# Altium schematic sheet pa.SchDoc: Class D DC/DC
size A4; Address4: Niklas Fauth; Revision: V1.0; SheetNumber: 3; SheetTotal: 5
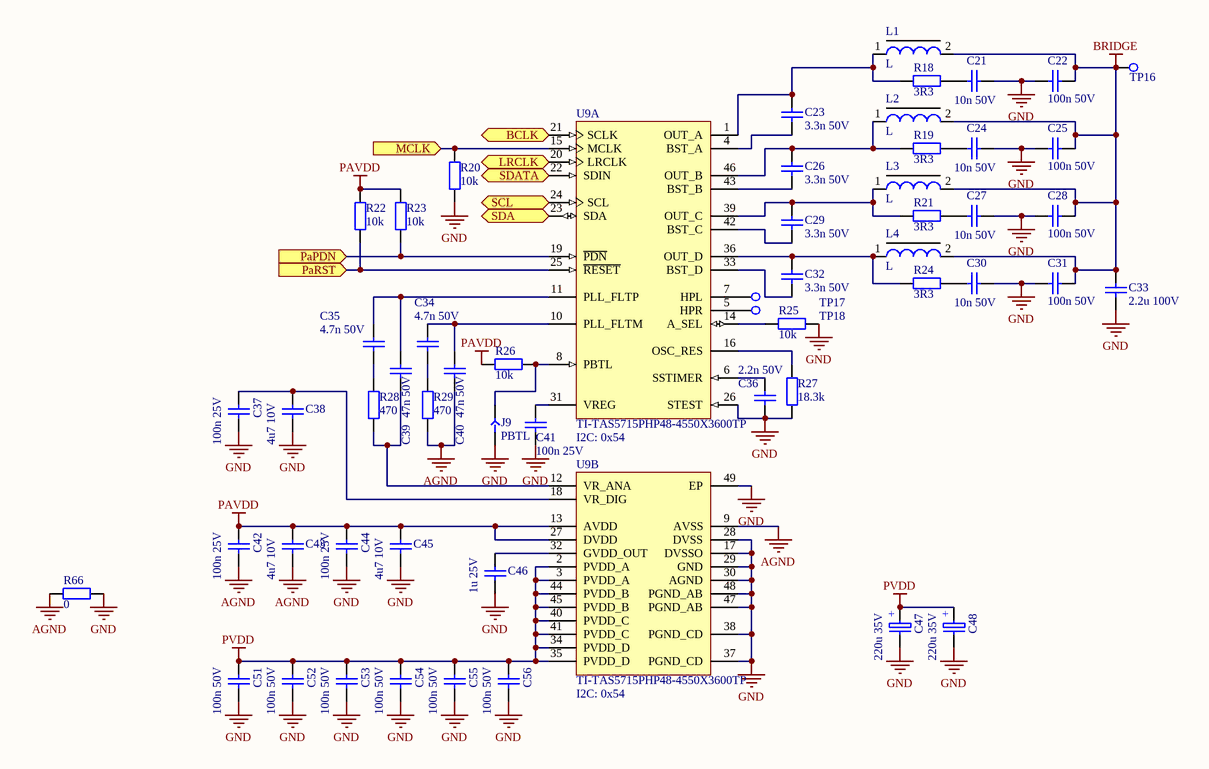
[diagram p0: pa.SchDoc]

## Parts
C21  10n 50V  [C-0603-H]
C22  100n 50V  [C-0805-H]
C23  3.3n 50V  [C-0603-H]
C24  10n 50V  [C-0603-H]
C25  100n 50V  [C-0805-H]
C26  3.3n 50V  [C-0603-H]
C27  10n 50V  [C-0603-H]
C28  100n 50V  [C-0805-H]
C29  3.3n 50V  [C-0603-H]
C30  10n 50V  [C-0603-H]
C31  100n 50V  [C-0805-H]
C32  3.3n 50V  [C-0603-H]
C33  2.2u 100V  [C-1210-M]
C34  4.7n 50V  [C-0603-H]
C35  4.7n 50V  [C-0603-H]
C36  2.2n 50V  [C-0603-H]
C37  100n 25V  [C-0603-H]
C38  4u7 10V  [C-0603-H]
C39  47n 50V  [C-0603-M]
C40  47n 50V  [C-0603-M]
C41  100n 25V  [C-0603-H]
C42  100n 25V  [C-0603-H]
C43  4u7 10V  [C-0603-H]
C44  100n 25V  [C-0603-H]
C45  4u7 10V  [C-0603-H]
C46  1u 25V  [C-0603-H]
C47  220u 35V  [SMD-10x10]
C48  220u 35V  [SMD-10x10]
C51  100n 50V  [C-0603-H]
C52  100n 50V  [C-0603-H]
C53  100n 50V  [C-0603-H]
C54  100n 50V  [C-0603-H]
C55  100n 50V  [C-0603-H]
C56  100n 50V  [C-0603-H]
J9  PBTL  [jmpr]
L1  L  [L-SDR1105]
L2  L  [L-SDR1105]
L3  L  [L-SDR1105]
L4  L  [L-SDR1105]
R18  3R3  [R-0603-H]
R19  3R3  [R-0603-H]
R20  10k  [R-0603-H]
R21  3R3  [R-0603-H]
R22  10k  [R-0603-H]
R23  10k  [R-0603-H]
R24  3R3  [R-0603-H]
R25  10k  [R-0603-H]
R26  10k  [R-0603-H]
R27  18.3k  [R-0603-M]
R28  470  [R-0603-H]
R29  470  [R-0603-H]
R66  0  [R-0603-M]
TP16  TP-SMD  [TP]  (value not drawn)
TP17  TP-SMD  [TP]  (value not drawn)
TP18  TP-SMD  [TP]  (value not drawn)
U9  TI-TAS5715PHP48-4550X3600TP  [TI-PHP48-4550X3600TP_N]  (parts A,B of 2)

## Ports
BCLK (in), LRCLK (in), MCLK (in), PaPDN (in), PaRST (in), SCL (in), SDA (bidir), SDATA (in)

## Nets
AGND: C40.1 C42.1 C43.1 R29.1 R66.1 U9.9(AVSS)
BRIDGE: C22.1 C25.1 C28.1 C31.1 C33.1 L1.2 L2.2 L3.2 L4.2 TP16.1
GND: C21.1 C22.2 C24.1 C25.2 C27.1 C28.2 C30.1 C31.2 C33.2 C36.2 C37.1 C38.1 C41.1 C44.1 C45.1 C46.1 C47.1 C48.1 C51.1 C52.1 C53.1 C54.1 C55.1 C56.1 J9.1 R20.1 R25.2 R27.1 R66.2 U9.17(DVSSO) U9.26(STEST) U9.28(DVSS) U9.29(GND) U9.30(AGND) U9.37(PGND_CD) U9.38(PGND_CD) U9.47(PGND_AB) U9.48(PGND_AB) U9.49(EP)
PAVDD: C42.2 C43.2 C44.2 C45.2 R22.2 R23.2 R26.1 U9.13(AVDD) U9.27(DVDD)
PVDD: C47.2 C48.2 C51.2 C52.2 C53.2 C54.2 C55.2 C56.2 U9.2(PVDD_A) U9.3(PVDD_A) U9.34(PVDD_D) U9.35(PVDD_D) U9.40(PVDD_C) U9.41(PVDD_C) U9.44(PVDD_B) U9.45(PVDD_B)
BCLK: U9.21(SCLK) ; port BCLK
LRCLK: U9.20(LRCLK) ; port LRCLK
MCLK: R20.2 U9.15(MCLK) ; port MCLK
PaPDN: R23.1 U9.19(~{PDN}) ; port PaPDN
PaRST: R22.1 U9.25(~{RESET}) ; port PaRST
SCL: U9.24(SCL) ; port SCL
SDA: U9.23(SDA) ; port SDA
SDATA: U9.22(SDIN) ; port SDATA
NetC21_2: C21.2 R18.1
NetC23_1: C23.1 U9.4(BST_A)
NetC23_2: C23.2 L1.1 R18.2 U9.1(OUT_A)
NetC24_2: C24.2 R19.1
NetC26_1: C26.1 U9.43(BST_B)
NetC26_2: C26.2 L2.1 R19.2 U9.46(OUT_B)
NetC27_2: C27.2 R21.1
NetC29_1: C29.1 U9.42(BST_C)
NetC29_2: C29.2 L3.1 R21.2 U9.39(OUT_C)
NetC30_2: C30.2 R24.1
NetC32_1: C32.1 U9.33(BST_D)
NetC32_2: C32.2 L4.1 R24.2 U9.36(OUT_D)
NetC34_1: C34.1 R29.2
NetC34_2: C34.2 C40.2 U9.10(PLL_FLTM)
NetC35_1: C35.1 R28.2
NetC35_2: C35.2 C39.2 U9.11(PLL_FLTP)
NetC36_1: C36.1 U9.6(SSTIMER)
NetC37_2: C37.2 C38.2 U9.18(VR_DIG)
NetC39_1: C39.1 R28.1 U9.12(VR_ANA)
NetC41_2: C41.2 U9.31(VREG)
NetC46_2: C46.2 U9.32(GVDD_OUT)
NetJ9_2: J9.2 R26.2 U9.8(PBTL)
NetR25_1: R25.1 U9.14(A_SEL)
NetR27_2: R27.2 U9.16(OSC_RES)
NetTP17_1: TP17.1 U9.7(HPL)
NetTP18_1: TP18.1 U9.5(HPR)

## Notes on the sheet
- I2C: 0x54
- (near U9) I2C: 0x54
- Title
- Size:
- Date:
- A4
- Number:
- Time:
- Revision:
- Sheet
- of
- File:
- (in symbol CE-SMD-220u-35V) +

## Library data of the parts
C21 C24 C27 C30 = C-0603-10n-50V: Capacitor 10nF 50V; Supplier 1: Mouser; Supplier Part Number 1: 80-C0603C103K5RAC
C22 C25 C28 C31 = C-0805-100n-50V: Supplier 1: Mouser; Supplier Part Number 1: 80-C0805C104K5RAL
C23 C26 C29 C32 = C-0603-3n3-50V: Capacitor 3.3n 50V; Supplier 1: Mouser; Supplier Part Number 1: 80-C0603C332F5G
C33 = C-1210-2u2-100V: Capacitor 2.2uF 100V; Supplier 1: Mouser; Supplier Part Number 1: 80-C1210C225K1RAC
C34 C35 = C-0603-4n7-50V: Capacitor 4.7n 50V; Supplier 1: Mouser; Supplier Part Number 1: 80-C0603C472F5G
C36 = C-0603-2n2-50V: Capacitor 2.2n 50V; Supplier 1: Mouser; Supplier Part Number 1: 80-C0603C222F5G
C37 C41 C42 C44 = C-0603-100n-25V: Capacitor 100n 25V; Supplier 1: Mouser; Supplier Part Number 1: 80-C0603C104K3R
C38 C43 C45 = C-0603-4u7-10V: Capacitor 4.7uF 10V; Supplier 1: Mouser; Supplier Part Number 1: 80-C0603C475K8P
C39 C40 = C-0603-47n-50V_1: Capacitor 47nF 50V; Supplier 1: Mouser; Supplier Part Number 1: 80-C0603C473K5R
C46 = C-0603-1u-25V: Capacitor 1uF 25V; Supplier 1: Mouser; Supplier Part Number 1: 80-C0603C105K3R
C47 C48 = CE-SMD-220u-35V: electrolytic capacitor 220u 35V; Supplier 1: Mouser; Supplier Part Number 1: 661-EMZF350A221MJA0G
C51-C56 = C-0603-100n-50V: Capacitor 100n 50V; Supplier 1: Mouser; Supplier Part Number 1: 80-C0603C104K5RAUTO
J9 = jmpr
R18 R19 R21 R24 = R-0603-3R3: Resistor 3R3; Supplier 1: Mouser; Supplier Part Number 1: 71-CRCW06033R30FKEA
R20 R22 R23 R25 R26 = R-0603-10k: Resistor 10k; Supplier 1: Mouser; Supplier Part Number 1: 71-CRCW0603-10K-E3
R27 = R-0603-18k3: Resistor 18.3k; Supplier 1: Mouser; Supplier Part Number 1: 71-CRCW0603-18.3K-E3
R28 R29 = R-0603-470: Resistor 470; Supplier 1: Mouser; Supplier Part Number 1: 71-CRCW0603-470K-E3
R66 = R-0603-0: Resistor 0; Supplier 1: Mouser; Supplier Part Number 1: 71-CRCW0603-0-E3; Resistance: 0